# EAGLE design simple_h (EAGLE 5.06)
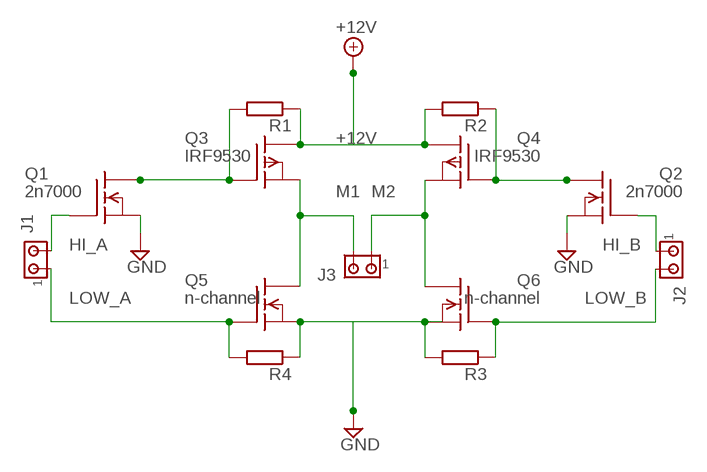
[diagram p0: schematic, sheet 1]

## Parts
J1  MTA02-100  [10X02MTA]
J2  MTA02-100  [10X02MTA]
J3  MTA02-100  [10X02MTA]
Q1  2n7000  BSS296  [TO92]
Q2  2n7000  BSS296  [TO92]
Q3  IRF9530  [TO220]
Q4  IRF9530  [TO220]
Q5  n-channel  SUP75N06-08  [TO220]
Q6  n-channel  SUP75N06-08  [TO220]
R1  R-EU_0204/5  [0204/5]
R2  R-EU_0204/5  [0204/5]
R3  R-EU_0204/5  [0204/5]
R4  R-EU_0204/5  [0204/5]

## Nets
+12V: Q3.2(D) Q4.2(D) R1.1 R2.2
GND: Q1.3(S) Q2.3(S) Q5.3(S) Q6.3(S) R3.2 R4.1
HI_A: J1.2 Q1.1(G)
HI_B: J2.1 Q2.1(G)
LOW_A: J1.1 Q5.1(G) R4.2
LOW_B: J2.2 Q6.1(G) R3.1
M1: J3.2 Q3.3(S) Q5.2(D)
M2: J3.1 Q4.3(S) Q6.2(D)
N$6: Q2.2(D) Q4.1(G) R2.1
N$8: Q1.2(D) Q3.1(G) R1.2

## Library data of the parts
J1-J3 = con-amp:MTA02-100: AMP connector
Q1 Q2 = transistor-fet:BSS296: N-Channel Enhancement MOSFET not checked
Q3 Q4 = transistor-fet:IRF9530: P-Channel Enhancement MOSFET (HEXFET); -100V; -12A; 0,3Ohm
Q5 Q6 = transistor-fet:SUP75N06-08: N-Channel Enhancement MOSFET 60V; 75A; 0,008Ohm
R1-R4 = resistor:R-EU_: RESISTOR, European symbol

## Board
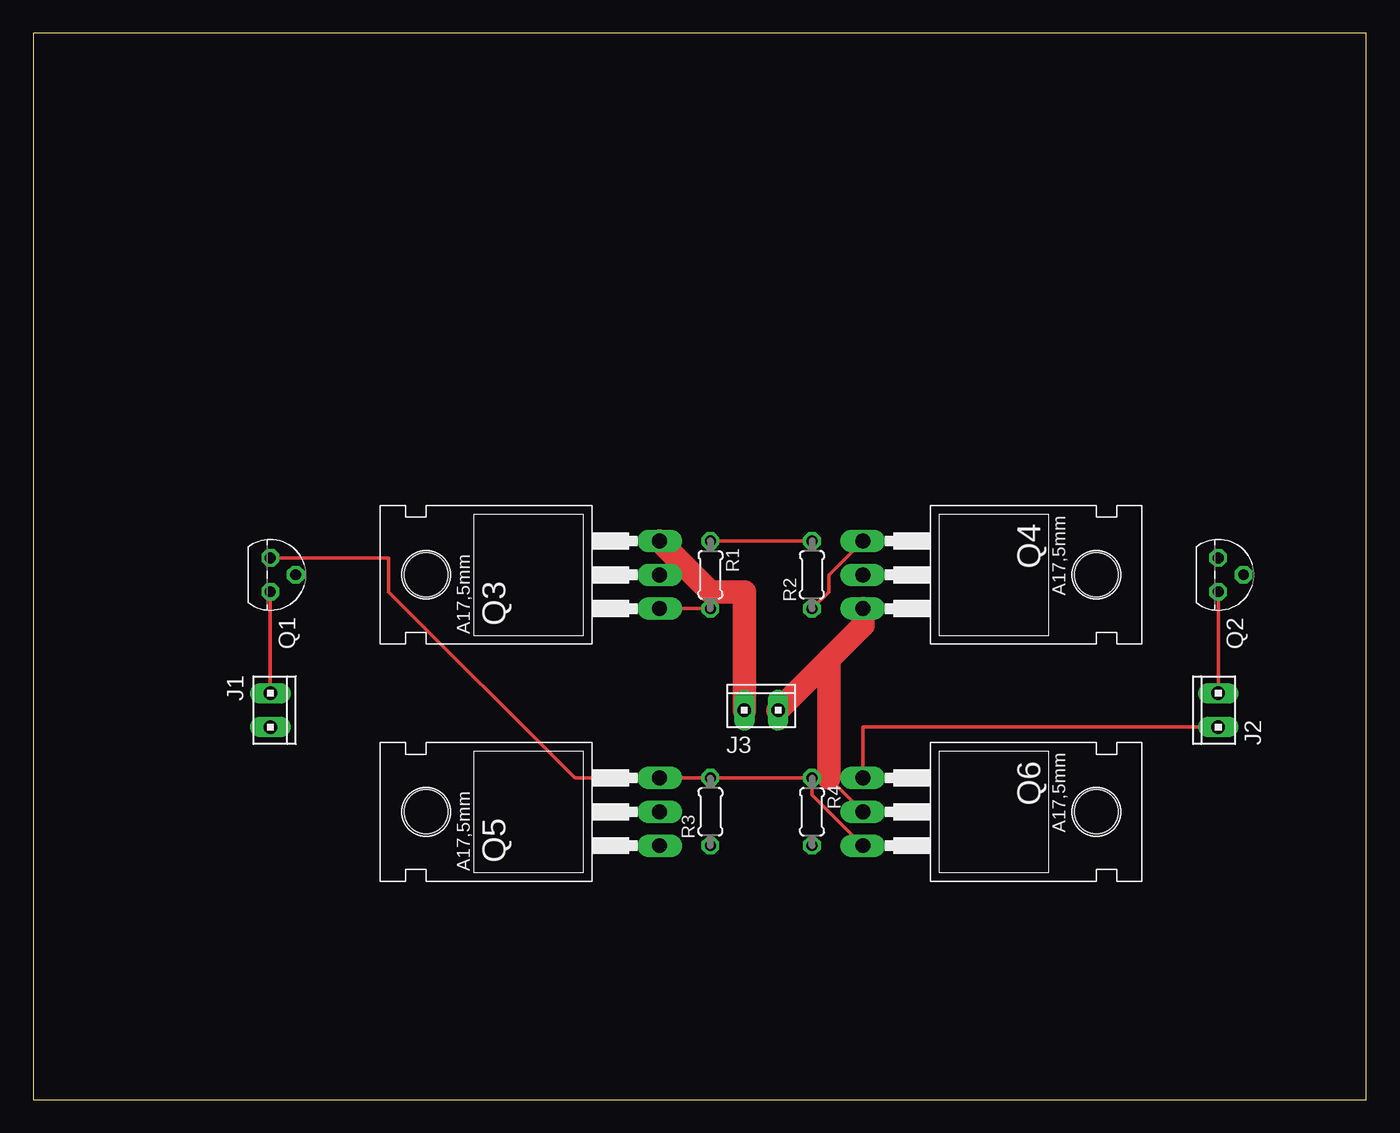
[diagram p1: board, top side]
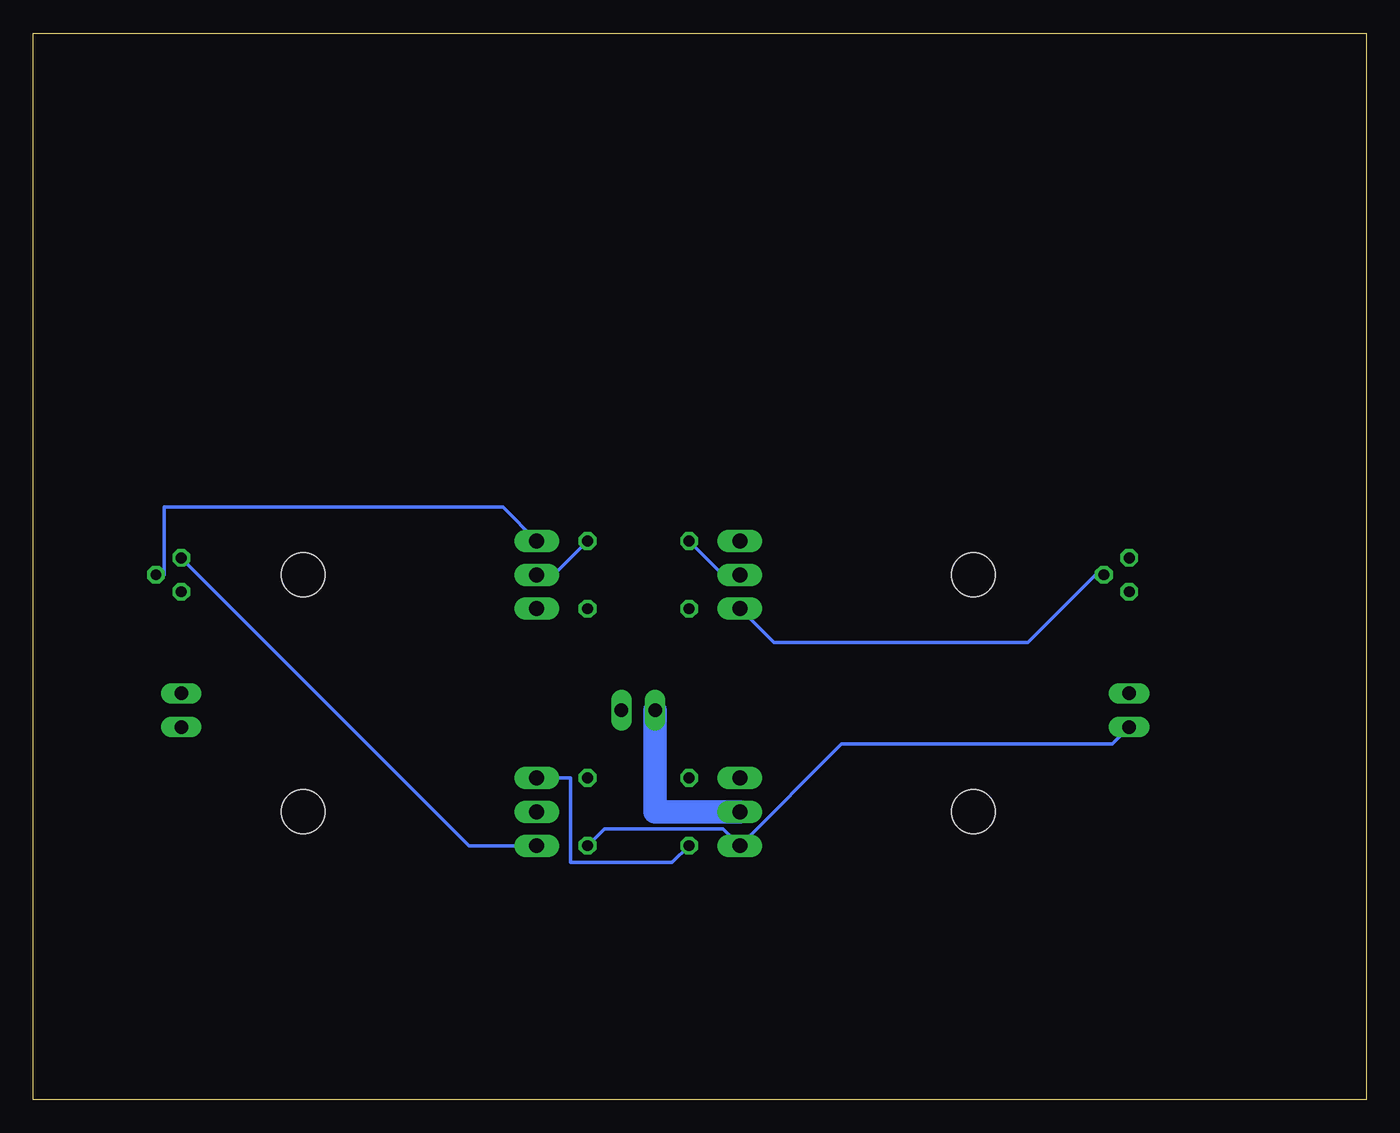
[diagram p2: board, bottom side, seen from below]

Size 100 x 80 mm. Coordinates in mm from the lower left corner, seen from the top.
Outline: 0,0 100,0 100,80 0,80 0,0
Copper layers (1*16): Top 0.035mm / dielectric 1.5mm / Bottom 0.035mm
Design rules "default": minimum track width 10mil, minimum drill 24mil, track to track 8mil, track to pad 8mil, pad to pad 8mil, via to via 8mil, smd to smd 8mil, copper to edge 40mil, drill to drill 8mil, minimum pad ring 10mil, minimum via ring 8mil, stop-mask expansion 4mil, vias tented up to drill 0mil, thermal gap 10mil

### Footprints (pad centres in the part's own frame; a part is rotated, then mirrored left to right if it is on the bottom)
10X02MTA = drill 1.016 long: 1 1.27,0; 2 -1.27,0
TO92 = drill 0.813 octagon: 1 1.27,0; 2 0,1.905; 3 -1.27,0
TO220 = drill 1.118 long: 1 -2.54,-6.35; 2 0,-6.35; 3 2.54,-6.35 | hole 3.302: 0,11.176
0204/5 = drill 0.813 octagon: 1 -2.54,0; 2 2.54,0

### Placement (x,y rotation side)
J1  17.78,29.21 270 top
J2  88.9,29.21 90 top
J3  54.61,29.21 0 top
Q1  17.78,39.37 270 top
Q2  88.9,39.37 270 top
Q3  40.64,39.37 90 top
Q4  68.58,39.37 270 top
Q5  40.64,21.59 90 top
Q6  68.58,21.59 270 top
R1  50.8,39.37 270 top
R2  58.42,39.37 90 top
R3  50.8,21.59 90 top
R4  58.42,21.59 270 top

### Tracks (layer width: path | path; a pad name or v marks a point on that pad's centre or on a via)
+12V
  Top 0.254: R1.1 R2.2
  Bottom 0.254: R1.1 48.26,39.37 Q3.2 | R2.2 60.96,39.37 Q4.2
GND
  Top 0.254: Q1.3 26.67,40.64 26.67,38.1 40.64,24.13 Q5.3 R3.2 R4.1 58.42,22.86 Q6.3
  Bottom 0.254: Q2.3 67.31,19.05 Q6.3
HI_A
  Top 0.254: J1.2 Q1.1
HI_B
  Top 0.254: J2.1 Q2.1
LOW_A
  Bottom 0.254: R4.2 57.15,20.32 48.26,20.32 Q5.1 39.37,26.67 19.05,26.67 J1.1
LOW_B
  Top 0.254: J2.2 62.23,27.94 Q6.1
  Bottom 0.254: R3.1 52.07,17.78 59.69,17.78 59.69,24.13 Q6.1
M1
  Top 1.778: Q3.3 50.8,38.1 53.34,38.1 J3.2
  Bottom 1.778: J3.2 53.34,21.59 Q5.2
M2
  Top 0.254: Q6.2 59.69,24.13
  Top 1.778: 59.69,33.02 62.23,35.56 Q4.3 | 59.69,33.02 J3.1 | 59.69,24.13 59.69,33.02
N$6
  Top 0.254: R2.1 59.69,38.1 59.69,39.37 Q4.1
  Bottom 0.254: Q4.1 64.77,44.45 90.17,44.45 90.17,39.37 Q2.2
N$8
  Top 0.254: Q3.1 R1.2
  Bottom 0.254: Q3.1 44.45,34.29 25.4,34.29 20.32,39.37 Q1.2